# EAGLE design K40_MiddleMan_002A (EAGLE 9.4.2)
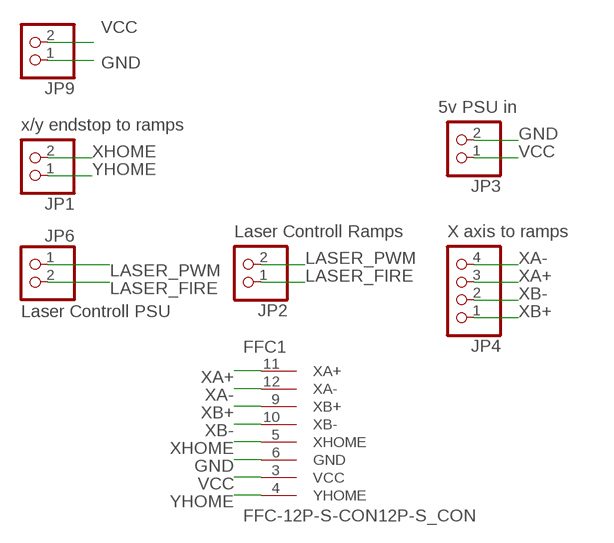
[diagram p0: schematic, sheet 1]

## Parts
FFC1  FFC-12P-S-CON12P-S_CON  [FFC]
JP1  PINHD-1X2  [1X02]
JP2  PINHD-1X2  [1X02]
JP3  PINHD-1X2  [1X02]
JP4  PINHD-1X4  [1X04]
JP6  PINHD-1X2  [1X02]
JP9  PINHD-1X2  [1X02]

## Nets
GND: FFC1.6(GND) JP3.2 JP9.1
LASER_FIRE: JP2.1 JP6.2
LASER_PWM: JP2.2 JP6.1
VCC: FFC1.3(VCC) JP3.1 JP9.2
XA+: FFC1.11(XA+) JP4.3
XA-: FFC1.12(XA-) JP4.4
XB+: FFC1.9(XB+) JP4.1
XB-: FFC1.10(XB-) JP4.2
XHOME: FFC1.5(XHOME) JP1.2
YHOME: FFC1.4(YHOME) JP1.1

## Notes on the sheet
- 5v PSU in
- x/y endstop to ramps
- Laser Controll Ramps | X axis to ramps
- Laser Controll PSU

## Library data of the parts
FFC1 = WeisTek:FFC-12P-S-CON
JP1-JP3 JP6 JP9 = pinhead:PINHD-1X2: PIN HEADER
JP4 = pinhead:PINHD-1X4: PIN HEADER

## Board
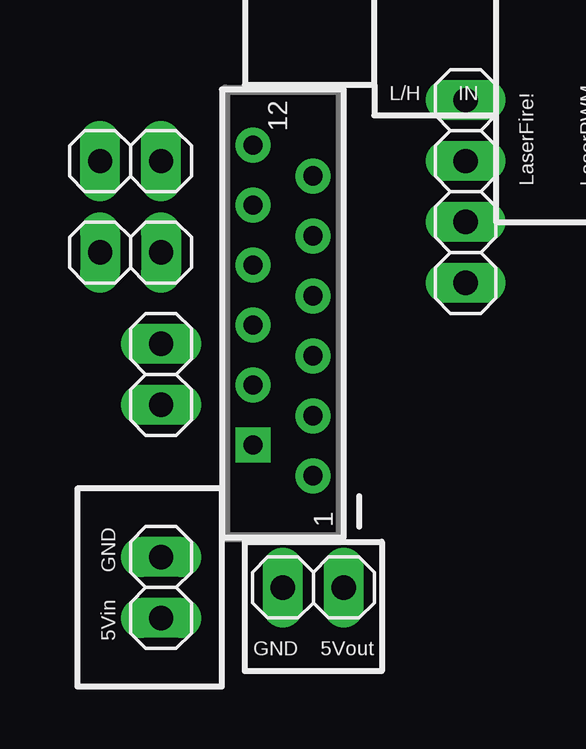
[diagram p1: board, top side]
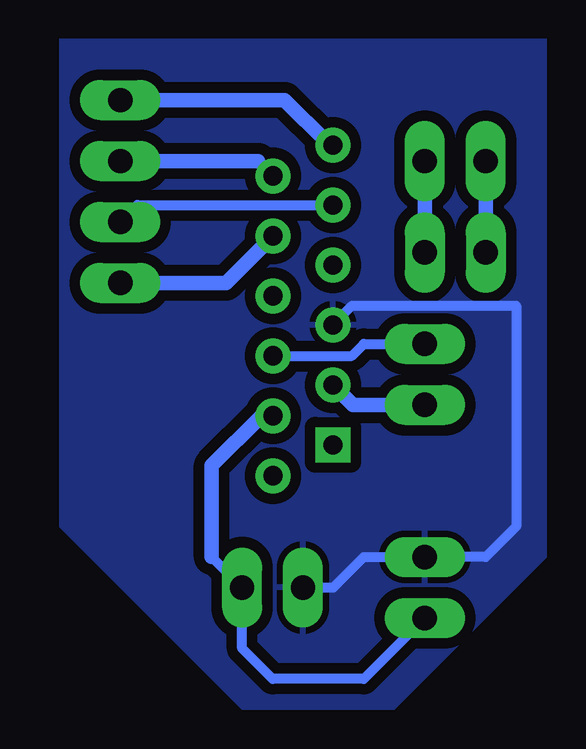
[diagram p2: board, bottom side, seen from below]

No outline drawn. Coordinates in mm, seen from the top.
Copper layers (1*16): Top 0.035mm / dielectric 1.5mm / Bottom 0.035mm
Design rules "singlesidedcncsuperaccurate *": minimum track width 6mil, minimum drill 0.35mm, track to track 8mil, track to pad 6mil, pad to pad 6mil, via to via 6mil, smd to smd 6mil, copper to edge 40mil, drill to drill 6mil, minimum pad ring 13mil, minimum via ring 8mil, stop-mask expansion 4mil, vias tented up to drill 0mil, thermal gap 10mil

### Footprints (pad centres in the part's own frame; a part is rotated, then mirrored left to right if it is on the bottom)
FFC = drill 0.8: 1 6.77,1.25; 3 4.27,1.25; 4 2.98,-1.25; 5 1.77,1.25; 6 0.48,-1.25; 7 -0.73,1.25; 8 -2.02,-1.25; 9 -3.23,1.25; 10 -4.52,-1.25; 11 -5.73,1.25; 12 -7.02,-1.25 | drill 0.8 square: 2 5.48,-1.25
1X02 = drill 1.016 long: 1 -1.27,0; 2 1.27,0
1X04 = drill 1.016 long: 1 -3.81,0; 2 -1.27,0; 3 1.27,0; 4 3.81,0

### Placement (x,y rotation side)
FFC1  7.62,13.97 270 top
JP1  2.54,11.43 90 top
JP2  1.27,20.32 0 top
JP3  2.54,2.54 90 top
JP4  15.24,19.05 90 top
JP6  1.27,16.51 180 top
JP9  8.89,2.54 0 top

### Tracks (layer width: path | path; a pad name or v marks a point on that pad's centre or on a via)
GND
  Bottom 0.406: JP9.1 6.35,2.54 5.08,3.81 JP3.2 0,3.81 -1.27,5.08 -1.27,14.29 5.57,14.29 FFC1.6
  pour Bottom (isolate 0.44, rank 6): -2.54,25.4 17.78,25.4 17.78,5.08 10.16,-2.54 3.81,-2.54 -2.54,3.81
LASER_FIRE
  Bottom 0.61: JP2.1 JP6.2
LASER_PWM
  Bottom 0.61: JP2.2 JP6.1
VCC
  Bottom 0.254: FFC1.3 8.89,9.68
  Bottom 0.406: JP3.1 5.08,-1.27 8.89,-1.27 10.16,0 JP9.2 11.43,3.81
  Bottom 0.61: 11.43,3.81 11.43,7.62 9.37,9.68 8.89,9.68
XA+
  Bottom 0.254: FFC1.11 9.49,20.32
  Bottom 0.61: 9.49,20.32 JP4.3
XA-
  Bottom 0.254: FFC1.12 6.6,21.08
  Bottom 0.61: JP4.4 8.38,22.86 6.6,21.08
XB+
  Bottom 0.61: FFC1.9 10.83,15.24 JP4.1
XB-
  Bottom 0.254: JP4.2 14.53,18.49
  Bottom 0.406: 14.53,18.49 FFC1.10
XHOME
  Bottom 0.406: FFC1.5 5.58,12.2 5.08,12.7 JP1.2
YHOME
  Bottom 0.61: FFC1.4 5.54,10.16 JP1.1

### Text on the board
tPlace: EStY | EStX | To PSU | From Ramps | L/H | IN | LaserFire! | LaserPWM | XA- | XA+ | XB- | Stepper X Axis | XB+ | GND | 5Vin | GND | 5Vout